# Altium schematic sheet DSP.SchDoc
size A4; PageSetup: Record=PageOptions|CenterHorizontal=True|CenterVertical=True|PrintScale=0.94|XCorrection=1.00|YCorrection=1.00|PrintKind=1|BorderSize=5000000|LeftOffset=0|BottomOffset=0|Orientation=2|PaperLength=1000|PaperWidth=1000|Scale=100|PaperSource=15|PrintQuality=1200|MediaType=1|DitherType=10|PaperKind=Letter|PrintScaleMode=1
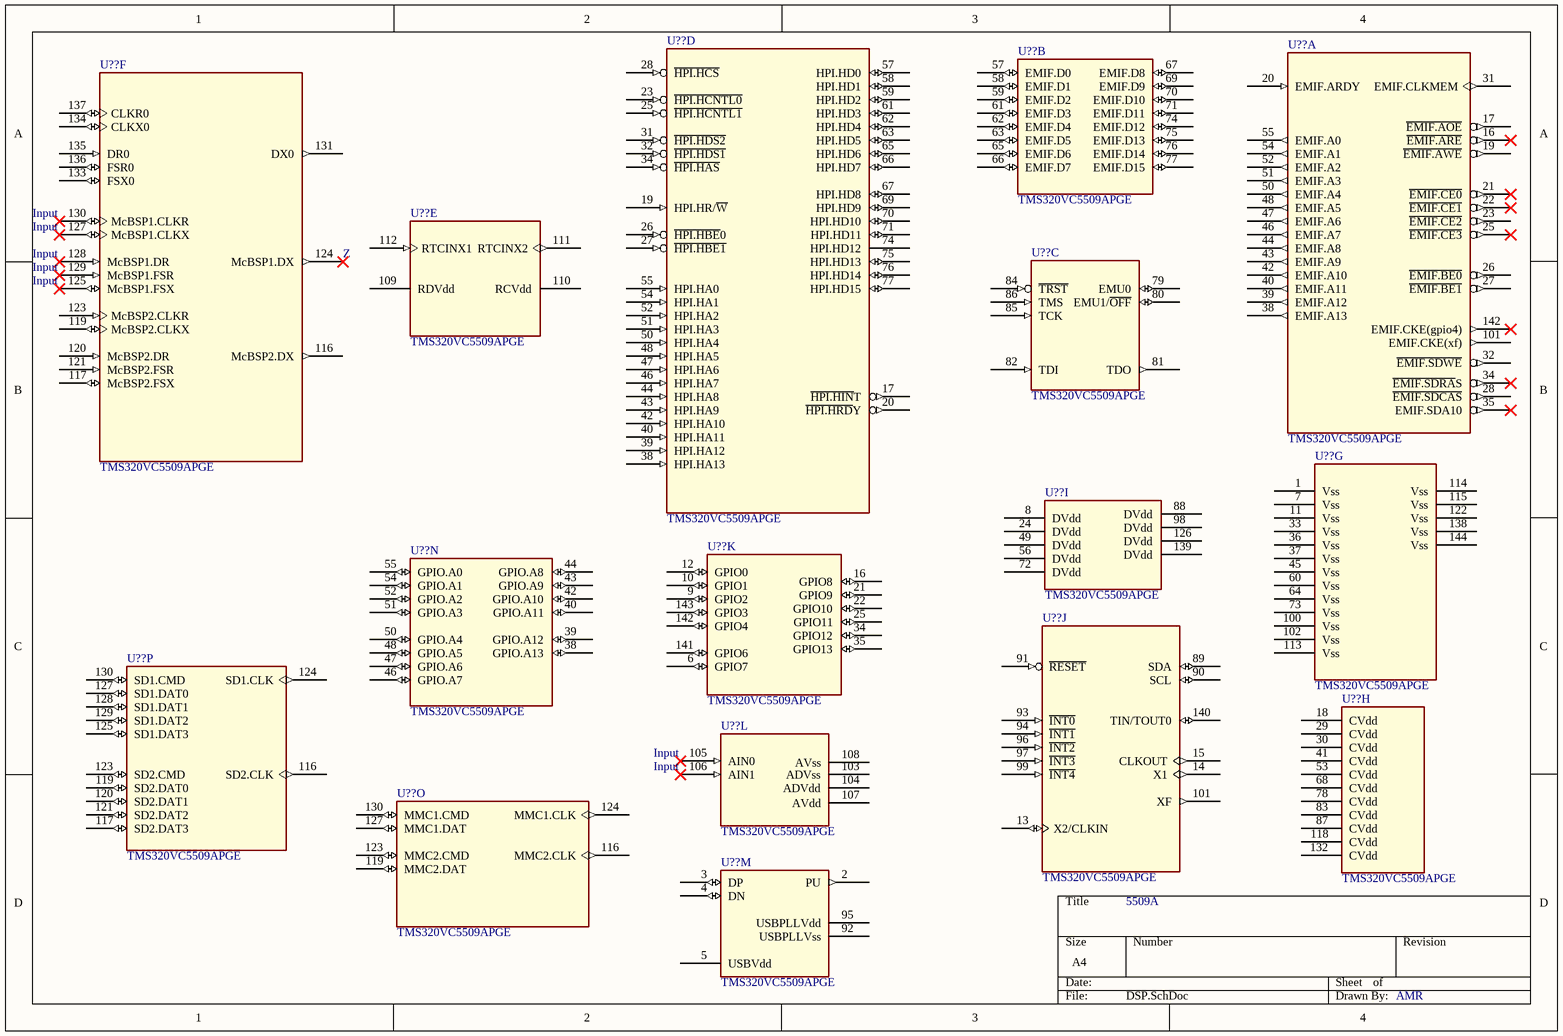
[diagram p0: DSP.SchDoc]

## Parts
(Parts that share a designator on the sheet are numbered #1, #2 ... from top to bottom, then left to right.)
U??#1  TMS320VC5509APGE  [TMSVC5509APGA]  (part D of 16)
U??#2  TMS320VC5509APGE  [TMSVC5509APGA]  (part A of 16)
U??#3  TMS320VC5509APGE  [TMSVC5509APGA]  (part B of 16)
U??#4  TMS320VC5509APGE  [TMSVC5509APGA]  (part F of 16)
U??#5  TMS320VC5509APGE  [TMSVC5509APGA]  (part E of 16)
U??#6  TMS320VC5509APGE  [TMSVC5509APGA]  (part C of 16)
U??#7  TMS320VC5509APGE  [TMSVC5509APGA]  (part G of 16)
U??#8  TMS320VC5509APGE  [TMSVC5509APGA]  (part I of 16)
U??#9  TMS320VC5509APGE  [TMSVC5509APGA]  (part K of 16)
U??#10  TMS320VC5509APGE  [TMSVC5509APGA]  (part N of 16)
U??#11  TMS320VC5509APGE  [TMSVC5509APGA]  (part J of 16)
U??#12  TMS320VC5509APGE  [TMSVC5509APGA]  (part P of 16)
U??#13  TMS320VC5509APGE  [TMSVC5509APGA]  (part H of 16)
U??#14  TMS320VC5509APGE  [TMSVC5509APGA]  (part L of 16)
U??#15  TMS320VC5509APGE  [TMSVC5509APGA]  (part O of 16)
U??#16  TMS320VC5509APGE  [TMSVC5509APGA]  (part M of 16)

## Nets

Not connected (* = marked no-connect by the designer): U??#1 17(~{HPI.HIN}T) 19(HPI.HR/~{W}) 20(~{HPI.HRD}Y) 23(~{HPI.HCNTL0}) 25(~{HPI.HCNTL1}) 26(~{HPI.HBE}0) 27(~{HPI.HBE1}) 28(~{HPI.HCS}) 31(~{HPI.HDS2}) 32(~{HPI.HDS1}) 34(~{HPI.HAS}) 38(HPI.HA13) 39(HPI.HA12) 40(HPI.HA11) 42(HPI.HA10) 43(HPI.HA9) 44(HPI.HA8) 46(HPI.HA7) 47(HPI.HA6) 48(HPI.HA5) 50(HPI.HA4) 51(HPI.HA3) 52(HPI.HA2) 54(HPI.HA1) 55(HPI.HA0) 57(HPI.HD0) 58(HPI.HD1) 59(HPI.HD2) 61(HPI.HD3) 62(HPI.HD4) 63(HPI.HD5) 65(HPI.HD6) 66(HPI.HD7) 67(HPI.HD8) 69(HPI.HD9) 70(HPI.HD10) 71(HPI.HD11) 74(HPI.HD12) 75(HPI.HD13) 76(HPI.HD14) 77(HPI.HD15); U??#2 16(~{EMIF.ARE})* 17(~{EMIF.AOE}) 19(~{EMIF.AWE}) 20(EMIF.ARDY) 21(~{EMIF.CE0})* 22(~{EMIF.CE1})* 23(~{EMIF.CE2}) 25(~{EMIF.CE3})* 26(~{EMIF.BE0}) 27(~{EMIF.BE1}) 28(~{EMIF.SDCAS}) 31(EMIF.CLKMEM) 32(~{EMIF.SDWE}) 34(~{EMIF.SDRA}S)* 35(EMIF.SDA10)* 38(EMIF.A13) 39(EMIF.A12) 40(EMIF.A11) 42(EMIF.A10) 43(EMIF.A9) 44(EMIF.A8) 46(EMIF.A7) 47(EMIF.A6) 48(EMIF.A5) 50(EMIF.A4) 51(EMIF.A3) 52(EMIF.A2) 54(EMIF.A1) 55(EMIF.A0) 101(EMIF.CKE(xf)) 142(EMIF.CKE(gpio4))*; U??#3 57(EMIF.D0) 58(EMIF.D1) 59(EMIF.D2) 61(EMIF.D3) 62(EMIF.D4) 63(EMIF.D5) 65(EMIF.D6) 66(EMIF.D7) 67(EMIF.D8) 69(EMIF.D9) 70(EMIF.D10) 71(EMIF.D11) 74(EMIF.D12) 75(EMIF.D13) 76(EMIF.D14) 77(EMIF.D15); U??#4 116(McBSP2.DX) 117(McBSP2.FSX) 119(McBSP2.CLKX) 120(McBSP2.DR) 121(McBSP2.FSR) 123(McBSP2.CLKR) 124(McBSP1.DX)* 125(McBSP1.FSX)* 127(McBSP1.CLKX)* 128(McBSP1.DR)* 129(McBSP1.FSR)* 130(McBSP1.CLKR)* 131(DX0) 133(FSX0) 134(CLKX0) 135(DR0) 136(FSR0) 137(CLKR0); U??#5 109(RDVdd) 110(RCVdd) 111(RTCINX2) 112(RTCINX1); U??#6 79(EMU0) 80(EMU1/~{OFF}) 81(TDO) 82(TDI) 84(~{TRST}) 85(TCK) 86(TMS); U??#7 1(Vss) 7(Vss) 11(Vss) 33(Vss) 36(Vss) 37(Vss) 45(Vss) 60(Vss) 64(Vss) 73(Vss) 100(Vss) 102(Vss) 113(Vss) 114(Vss) 115(Vss) 122(Vss) 138(Vss) 144(Vss); U??#8 8(DVdd) 24(DVdd) 49(DVdd) 56(DVdd) 72(DVdd) 88(DVdd) 98(DVdd) 126(DVdd) 139(DVdd); U??#9 6(GPIO7) 9(GPIO2) 10(GPIO1) 12(GPIO0) 16(GPIO8) 21(GPIO9) 22(GPIO10) 25(GPIO11) 34(GPIO12) 35(GPIO13) 141(GPIO6) 142(GPIO4) 143(GPIO3); U??#10 38(GPIO.A13) 39(GPIO.A12) 40(GPIO.A11) 42(GPIO.A10) 43(GPIO.A9) 44(GPIO.A8) 46(GPIO.A7) 47(GPIO.A6) 48(GPIO.A5) 50(GPIO.A4) 51(GPIO.A3) 52(GPIO.A2) 54(GPIO.A1) 55(GPIO.A0); U??#11 13(X2/CLKIN) 14(X1) 15(CLKOUT) 89(SDA) 90(SCL) 91(~{RESET}) 93(~{INT0}) 94(~{INT1}) 96(~{INT2}) 97(~{INT3}) 99(~{INT4}) 101(XF) 140(TIN/TOUT0); U??#12 116(SD2.CLK) 117(SD2.DAT3) 119(SD2.DAT0) 120(SD2.DAT1) 121(SD2.DAT2) 123(SD2.CMD) 124(SD1.CLK) 125(SD1.DAT3) 127(SD1.DAT0) 128(SD1.DAT1) 129(SD1.DAT2) 130(SD1.CMD); U??#13 18(CVdd) 29(CVdd) 30(CVdd) 41(CVdd) 53(CVdd) 68(CVdd) 78(CVdd) 83(CVdd) 87(CVdd) 118(CVdd) 132(CVdd); U??#14 103(ADVss) 104(ADVdd) 105(AIN0)* 106(AIN1)* 107(AVdd) 108(AVss); U??#15 116(MMC2.CLK) 119(MMC2.DAT) 123(MMC2.CMD) 124(MMC1.CLK) 127(MMC1.DAT) 130(MMC1.CMD); U??#16 2(PU) 3(DP) 4(DN) 5(USBVdd) 92(USBPLLVss) 95(USBPLLVdd)

## Notes on the sheet
- (near U??#4) Input
- (near U??#4) Z
- (near U??#14) Input
- 5509A
- AMR